# Altium project ESP32_Control_Board_Design.PrjPcb
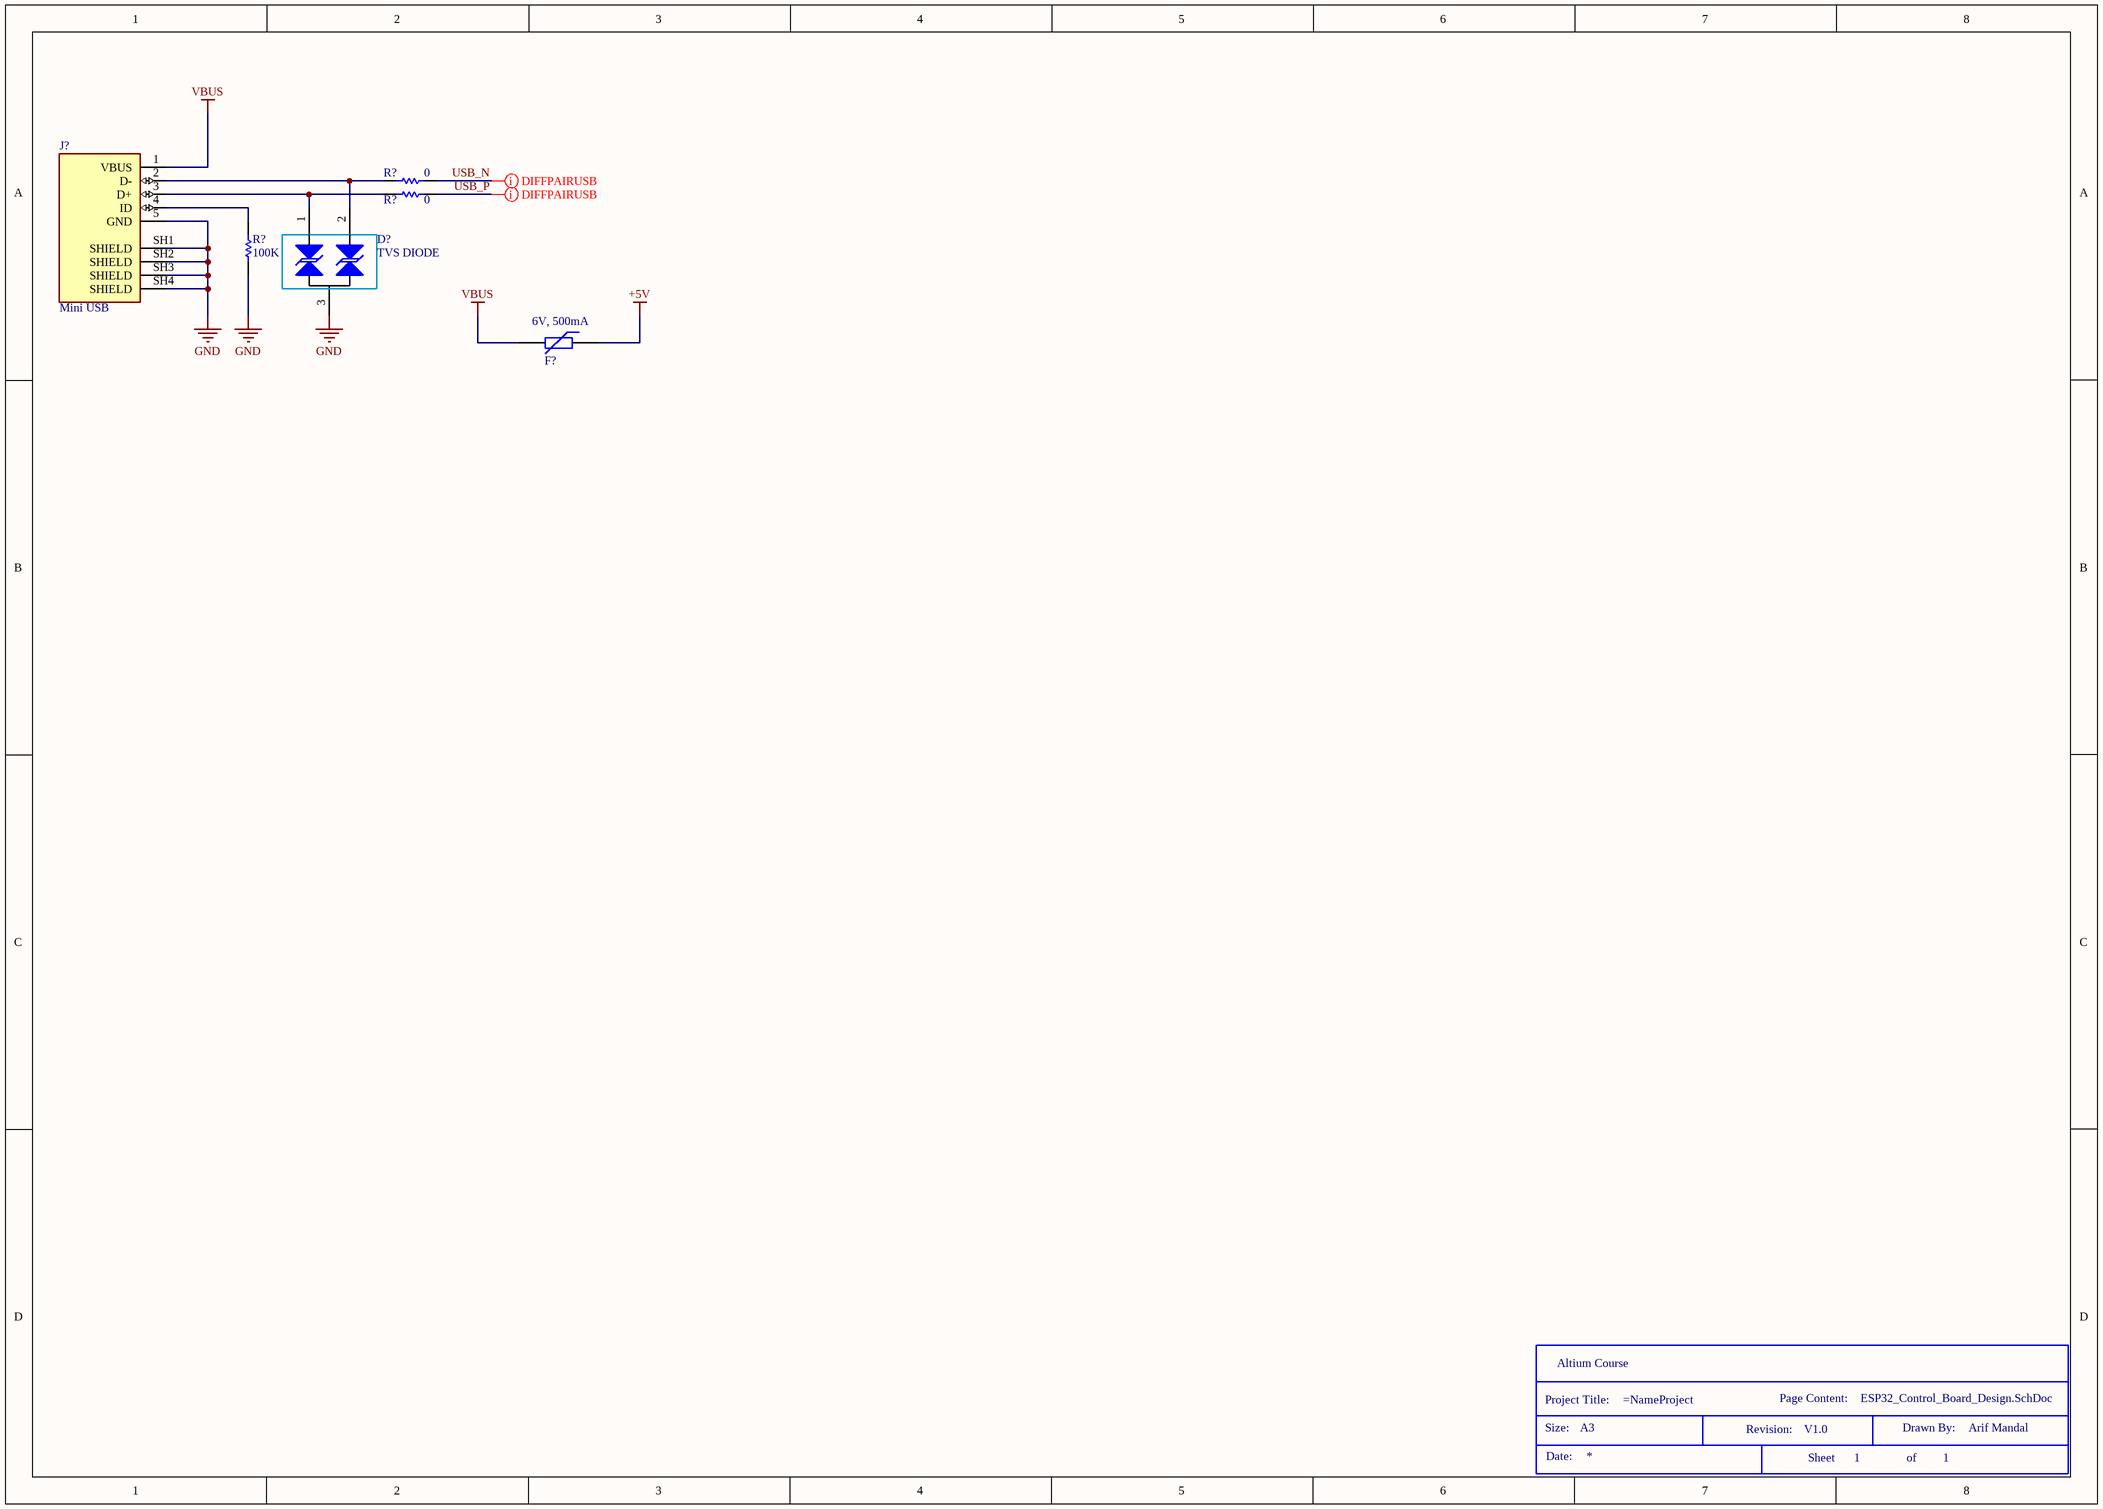
[diagram p0: ESP32_Control_Board_Design.SchDoc]
1 sheet, 7 parts. Net scope: global (net labels, ports and power ports of the same name join across sheets).
Board file: ESP32_Control_Board_Design.PcbDoc

## Sheet ESP32_Control_Board_Design.SchDoc
size A3; DrawnBy: Arif Mandal; DocumentNumber: 1; Revision: V1.0; SheetNumber: 1; SheetTotal: 1

### Parts
(Parts that share a designator on the sheet are numbered #1, #2 ... from top to bottom, then left to right.)
*  Size: A3  Drawn By: Arif Mandal  (hidden comment: Title Block)  (graphical)
D?  TVS DIODE  [SOT-23]
F?  (no value)  [PTC-0805]
J?  Mini USB  [MiniUSB]
R?#1  0  [MY_0805]
R?#2  0  [MY_0805]
R?#3  100K  [MY_0805]

### Nets
+5V: F?.1
GND: D?.3(A) J?.5(GND) J?.SH1(SHIELD) J?.SH2(SHIELD) J?.SH3(SHIELD) J?.SH4(SHIELD) R?#3.2
VBUS: F?.2 J?.1(VBUS)
USB_N: R?#1.2
USB_P: R?#2.2
NetD?_1: D?.1(K) J?.3(D+) R?#2.1
NetD?_2: D?.2(K) J?.2(D-) R?#1.1
NetJ?_4: J?.4(ID) R?#3.1

### Layout directives
differential pair; differential pair class DiffPairUSB: USB_N, USB_P

### Notes on the sheet
- (near F?) 6V, 500mA
- (in symbol Title Block) Altium Course; Project Title:; Page Content:; Size:; Revision:; Drawn By:; Date:; Sheet; of

### Library data of the parts
D? = SM712
F? = PTC: Published: 24-Mar-1999; PackageVersion: Mar-2003; PackageReference: 6-0805
J? = Mini USB: MINI USB 2.0- B Type Receptacle conn. Right Angle Surface Mount Type; MF: Amphenol ICC; MP: 10033526-N3212LF; SnapEDA_Link: https://www.snapeda.com/parts/10033526-N3212LF/Amphenol+FCI/view-part/?ref=snap; Package: None; Value: *; Check_prices: https://www.snapeda.com/parts/10033526-N3212LF/Amphenol+FCI/view-part/?ref=eda
R?#1-R?#3 = Res: Standard resistor; ASiD Part Number: Res-AS
  R?#1 R?#2: Value: 0
  R?#3: Value: 100K